# Altium schematic sheet agv_drv.SchDoc
size A2; SheetNumber: 1; SheetTotal: 1; SPICEModelCacheEXLCZDAJ: <root> / <DocumentId>EXLCZDAJ</DocumentId> / <CacheFrame Number="0"> / <Model Name="cap" Kind="MDL"> / <Text>*Default semiconductor capacitor / .MODEL CAP C()</Text> / </Model> / </CacheFrame> / </root>
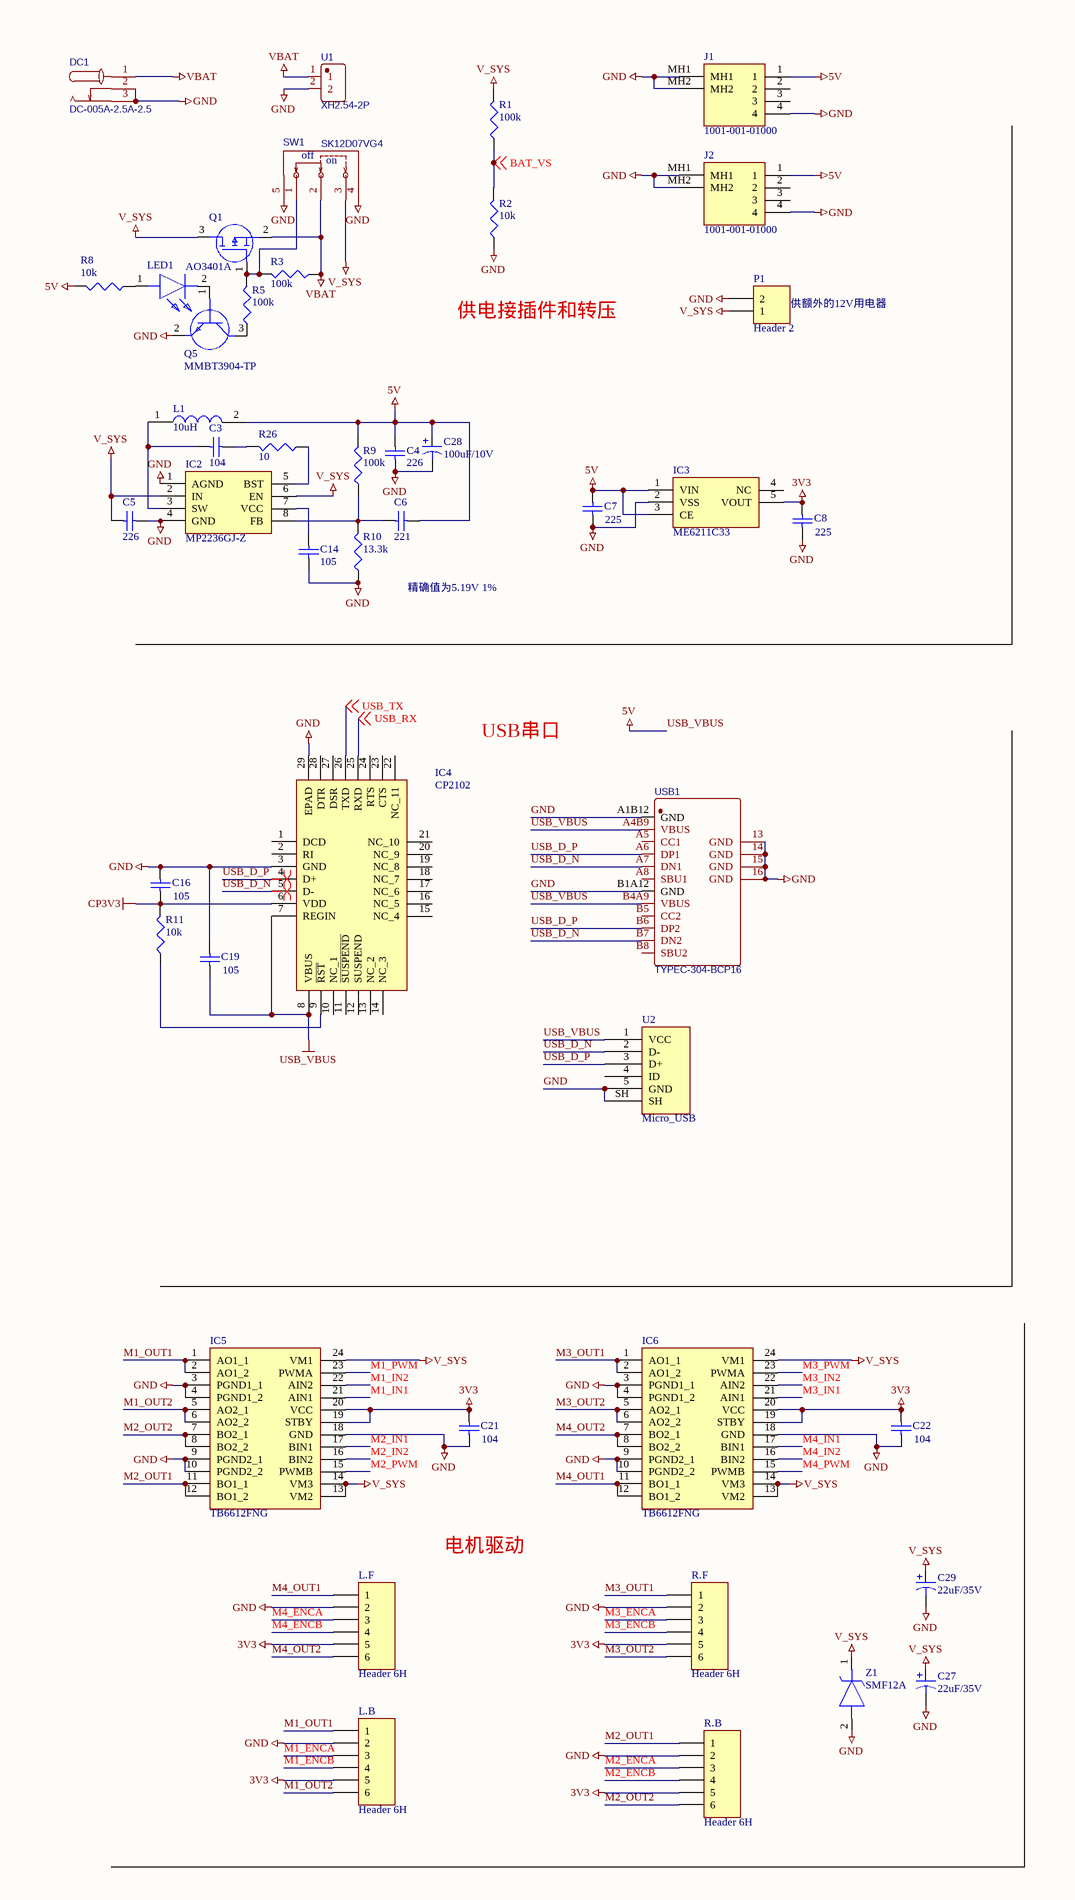
[diagram p0: agv_drv.SchDoc, left]
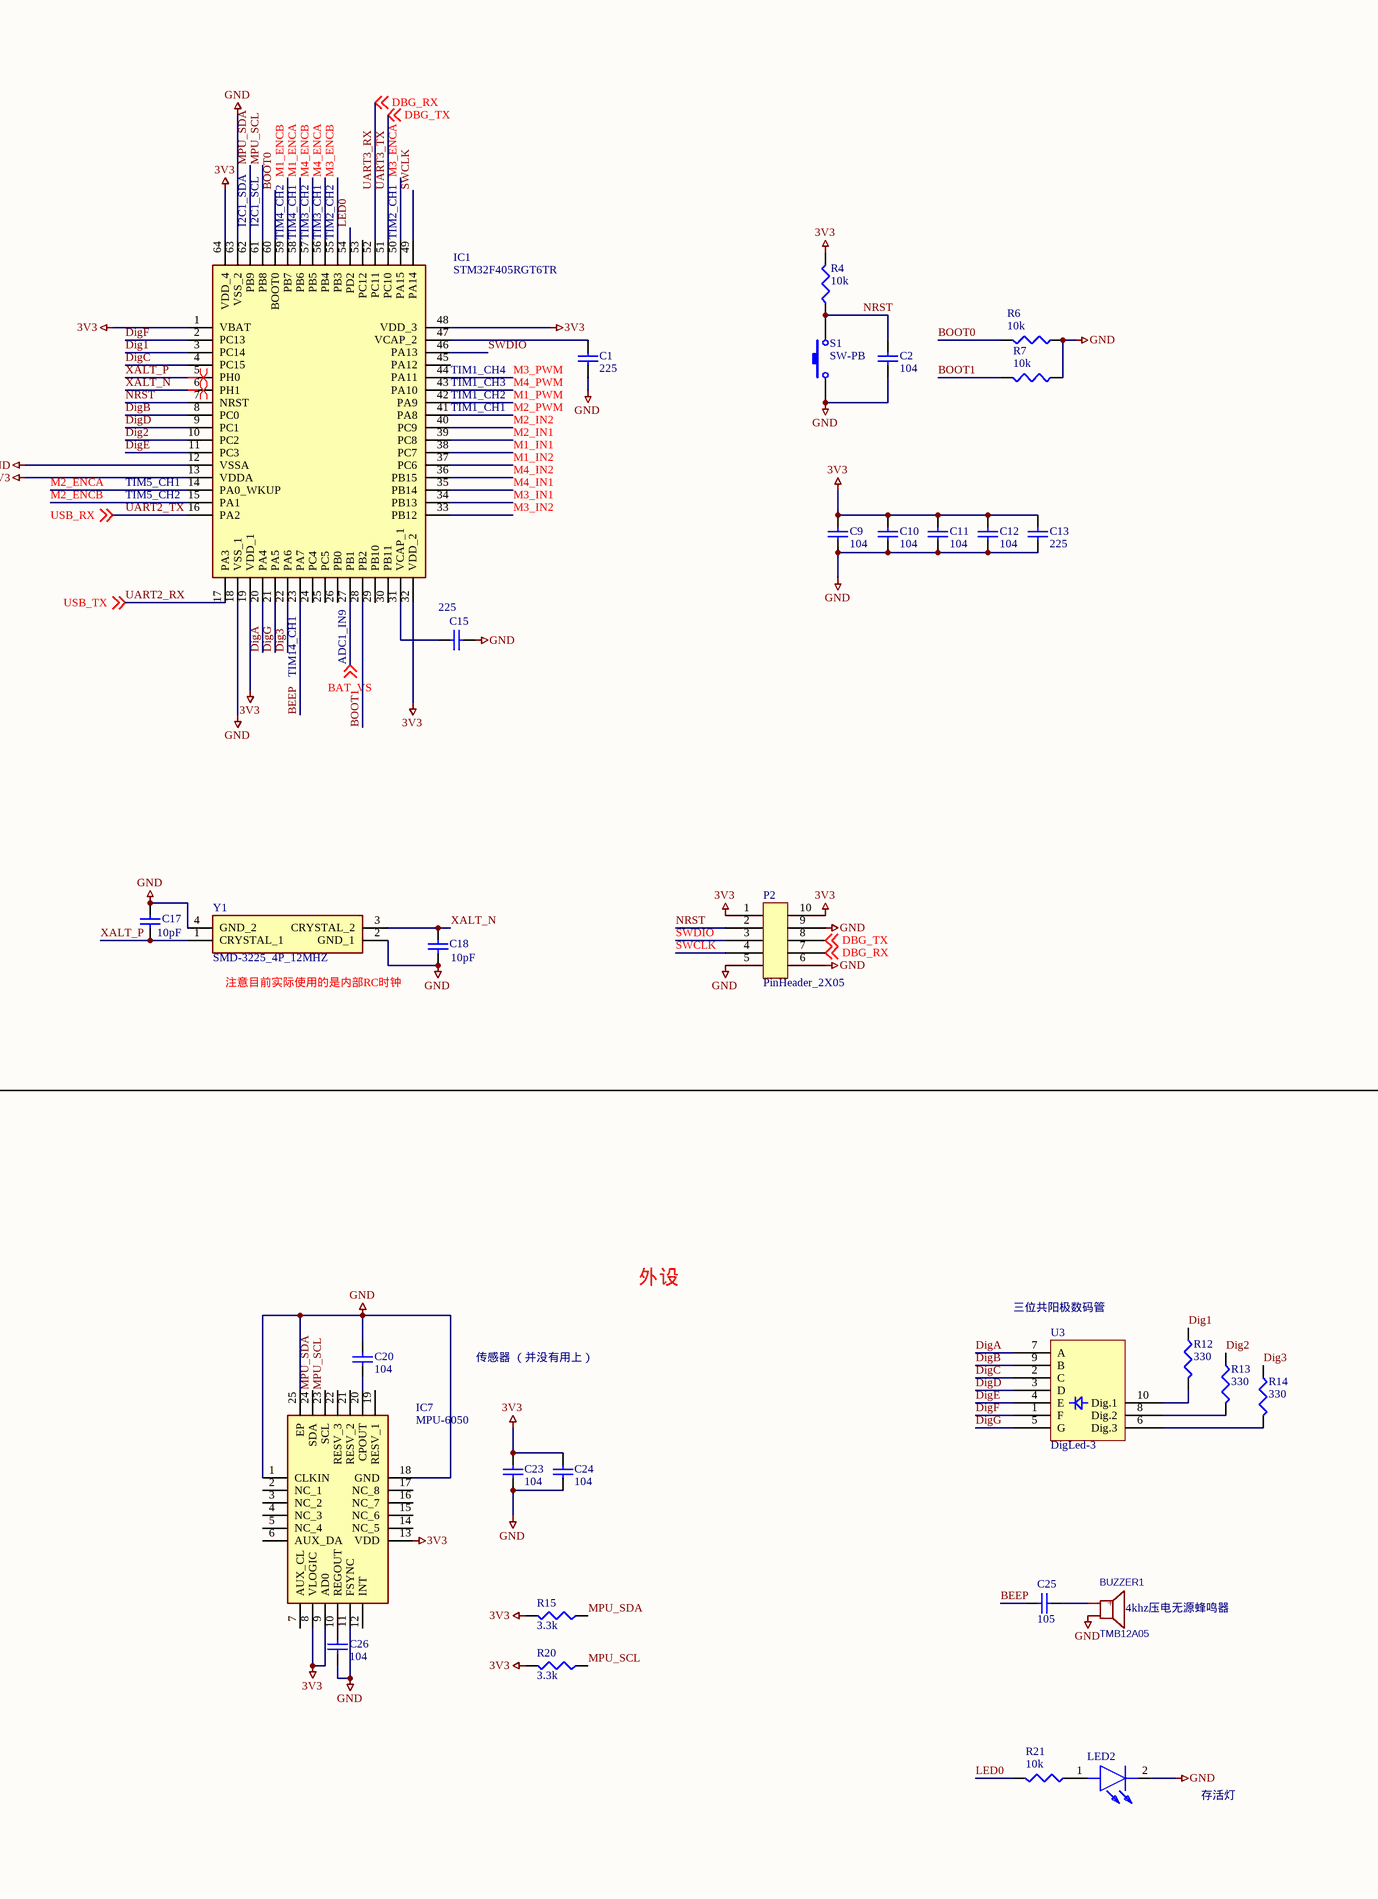
[diagram p1: agv_drv.SchDoc, right]

## Parts
BUZZER1  TMB12A05  [BUZ-TH_BD12.5-P6.50-D0.8-FD]
C1  225  [1608[0603]]
C2  104  [1608[0603]]
C3  104  [1608[0603]]
C4  226  [C1206]
C5  226  [C1206]
C6  221  [1608[0603]]
C7  225  [1608[0603]]
C8  225  [1608[0603]]
C9  104  [1608[0603]]
C10  104  [1608[0603]]
C11  104  [1608[0603]]
C12  104  [1608[0603]]
C13  225  [1608[0603]]
C14  105  [1608[0603]]
C15  225  [1608[0603]]
C16  105  [1608[0603]]
C17  10pF  [1608[0603]]
C18  10pF  [1608[0603]]
C19  105  [1608[0603]]
C20  104  [1608[0603]]
C21  104  [1608[0603]]
C22  104  [1608[0603]]
C23  104  [1608[0603]]
C24  104  [1608[0603]]
C25  105  [1608[0603]]
C26  104  [1608[0603]]
C27  22uF/35V  [CAPAE5550X54L]
C28  100uF/10V  [CAPAE5550X54L]
C29  22uF/35V  [CAPAE5550X54L]
DC1  DC-005A-2.5A-2.5  [DC-IN-TH_DC-005A-2.5A-2.5]
IC1  STM32F405RGT6TR  [QFP50P1200X1200X160-64N]
IC2  MP2236GJ-Z  [SOT65P280X100-8N]
IC3  ME6211C33  [SOT95P282X145-5N]
IC4  CP2102  [QFN50P500X500X100-29N-D]
IC5  TB6612FNG  [SOP65P760X160-24N]
IC6  TB6612FNG  [SOP65P760X160-24N]
IC7  MPU-6050  [QFN50P400X400X95-25N]
J1  1001-001-01000  [100100101000]
J2  1001-001-01000  [100100101000]
L1  10uH  [INDPM7266X300N]
L.B  Header 6H  [HDR2.0-LI-6P]
L.F  Header 6H  [HDR2.0-LI-6P]
LED1  LED0805  [LED0805]  (value not drawn)
LED2  LED0805  [LED0805]  (value not drawn)
P1  Header 2  [PinSocket_1X02_P5.00MM]
P2  PinHeader_2X05  [SidePinHeader_2x05_P2.54mm]
Q1  AO3401A  [SOT95P280X125-3N]
Q5  MMBT3904-TP  [SOT95P280X125-3N]
R1  100k  [J1-0603]
R2  10k  [J1-0603]
R3  100k  [J1-0603]
R4  10k  [J1-0603]
R5  100k  [J1-0603]
R6  10k  [J1-0603]
R7  10k  [J1-0603]
R8  10k  [J1-0603]
R9  100k  [J1-0603]
R10  13.3k  [J1-0603]
R11  10k  [J1-0603]
R12  330  [J1-0603]
R13  330  [J1-0603]
R14  330  [J1-0603]
R15  3.3k  [J1-0603]
R20  3.3k  [J1-0603]
R21  10k  [J1-0603]
R26  10  [J1-0603]
R.B  Header 6H  [HDR2.0-LI-6P]
R.F  Header 6H  [HDR2.0-LI-6P]
S1  SW-PB  [SW_PB2_A1]
SW1  SK12D07VG4  [SW-TH_SK12D07VG4]
U1  XH2.54-2P  [CONN-TH_XH2.54-2P]
U2  Micro_USB  [MicroUSB]
U3  DigLed-3  [DigLed-3-0.25inch]
USB1  TYPEC-304-BCP16  [USB-C-SMD_TYPEC-304-BCP16]
Y1  SMD-3225_4P_12MHZ  [SMD3225_4P12288MHZ12PF10PPM4085]
Z1  SMF12A  [SODFL3718X108N]

## Nets
3V3: C8.2 C9.2 C10.2 C11.2 C12.2 C13.2 C21.1 C22.1 C23.2 C24.2 IC1.1(VBAT) IC1.13(VDDA) IC1.19(VDD_1) IC1.32(VDD_2) IC1.48(VDD_3) IC1.64(VDD_4) IC3.5(VOUT) IC5.19(STBY) IC5.20(VCC) IC6.19(STBY) IC6.20(VCC) IC7.8(VLOGIC) IC7.9(AD0) IC7.13(VDD) L.B.5 L.F.5 P2.1 P2.10 R4.2 R15.2 R20.2 R.B.5 R.F.5
CP3V3: C16.1 IC4.6(VDD) R11.2
GND: BUZZER1.2 C1.2 C2.1 C4.1 C5.1 C7.1 C8.1 C9.1 C10.1 C11.1 C12.1 C13.1 C14.2 C15.2 C16.2 C17.2 C18.1 C19.2 C20.2 C21.2 C22.2 C23.1 C24.1 C26.1 C27.2 C28.2 C29.2 DC1.2 DC1.3 IC1.12(VSSA) IC1.18(VSS_1) IC1.63(VSS_2) IC2.1(AGND) IC2.4(GND) IC3.2(VSS) IC4.3(GND) IC4.29(EPAD) IC5.3(PGND1_1) IC5.4(PGND1_2) IC5.9(PGND2_1) IC5.10(PGND2_2) IC5.18(GND) IC6.3(PGND1_1) IC6.4(PGND1_2) IC6.9(PGND2_1) IC6.10(PGND2_2) IC6.18(GND) IC7.1(CLKIN) IC7.11(FSYNC) IC7.18(GND) IC7.25(EP) J1.4 J1.MH1 J1.MH2 J2.4 J2.MH1 J2.MH2 L.B.2 L.F.2 LED2.2(K) P1.2 P2.5 P2.6 P2.9 Q5.2(E) R2.1 R6.1 R7.1 R10.1 R.B.2 R.F.2 S1.1 SW1.4 SW1.5 U1.2 U2.5(GND) U2.SH USB1.13(GND) USB1.14(GND) USB1.15(GND) USB1.16(GND) USB1.A1B12(GND) USB1.B1A12(GND) Y1.2(GND_1) Y1.4(GND_2) Z1.2(A)
USB_VBUS: C4.2 C6.1 C7.2 C19.1 C28.1 IC3.1(VIN) IC3.3(CE) IC4.7(REGIN) IC4.8(VBUS) J1.1 J2.1 L1.2 R8.2 R9.2 U2.1(VCC) USB1.A4B9(VBUS) USB1.B4A9(VBUS)  [also labelled 5V]
V_SYS: C5.2 C27.1 C29.1 IC2.2(IN) IC2.6(EN) IC5.13(VM2) IC5.14(VM3) IC5.24(VM1) IC6.13(VM2) IC6.14(VM3) IC6.24(VM1) P1.1 Q1.3(D) R1.2 SW1.3 Z1.1(K)
VBAT: DC1.1 Q1.2(S) R3.1 SW1.2 U1.1
BAT_VS: IC1.27(PB1) R1.1 R2.2 ; off-sheet BAT_VS
BEEP: C25.2 IC1.23(PA7)
BOOT0: IC1.60(BOOT0) R6.2
BOOT1: IC1.28(PB2) R7.2
Dig1: IC1.3(PC14) R12.1
Dig2: IC1.10(PC2) R13.1
Dig3: IC1.22(PA6) R14.1
DigA: IC1.20(PA4) U3.7(A)
DigB: IC1.8(PC0) U3.9(B)
DigC: IC1.4(PC15) U3.2(C)
DigD: IC1.9(PC1) U3.3(D)
DigE: IC1.11(PC3) U3.4(E)
DigF: IC1.2(PC13) U3.1(F)
DigG: IC1.21(PA5) U3.5(G)
LED0: IC1.54(PD2) R21.2
M1_ENCA: IC1.58(PB6) L.B.3
M1_ENCB: IC1.59(PB7) L.B.4
M1_IN1: IC1.38(PC7) IC5.21(AIN1)
M1_IN2: IC1.37(PC6) IC5.22(AIN2)
M1_OUT1: IC5.1(AO1_1) IC5.2(AO1_2) L.B.1
M1_OUT2: IC5.5(AO2_1) IC5.6(AO2_2) L.B.6
M1_PWM: IC1.42(PA9) IC5.23(PWMA)
M2_ENCA: IC1.14(PA0_WKUP) R.B.3
M2_ENCB: IC1.15(PA1) R.B.4
M2_IN1: IC1.39(PC8) IC5.17(BIN1)
M2_IN2: IC1.40(PC9) IC5.16(BIN2)
M2_OUT1: IC5.11(BO1_1) IC5.12(BO1_2) R.B.1
M2_OUT2: IC5.7(BO2_1) IC5.8(BO2_2) R.B.6
M2_PWM: IC1.41(PA8) IC5.15(PWMB)
M3_ENCA: IC1.50(PA15) R.F.3
M3_ENCB: IC1.55(PB3) R.F.4
M3_IN1: IC1.34(PB13) IC6.21(AIN1)
M3_IN2: IC1.33(PB12) IC6.22(AIN2)
M3_OUT1: IC6.1(AO1_1) IC6.2(AO1_2) R.F.1
M3_OUT2: IC6.5(AO2_1) IC6.6(AO2_2) R.F.6
M3_PWM: IC1.44(PA11) IC6.23(PWMA)
M4_ENCA: IC1.56(PB4) L.F.3
M4_ENCB: IC1.57(PB5) L.F.4
M4_IN1: IC1.35(PB14) IC6.17(BIN1)
M4_IN2: IC1.36(PB15) IC6.16(BIN2)
M4_OUT1: IC6.11(BO1_1) IC6.12(BO1_2) L.F.1
M4_OUT2: IC6.7(BO2_1) IC6.8(BO2_2) L.F.6
M4_PWM: IC1.43(PA10) IC6.15(PWMB)
MPU_SCL: IC1.61(PB8) IC7.23(SCL) R20.1
MPU_SDA: IC1.62(PB9) IC7.24(SDA) R15.1
NRST: C2.2 IC1.7(NRST) P2.2 R4.1 S1.2
SWCLK: IC1.49(PA14) P2.4
SWDIO: IC1.46(PA13) P2.3
UART2_RX: IC1.17(PA3) IC4.26(TXD) ; off-sheet USB_TX  [also labelled USB_TX]
UART2_TX: IC1.16(PA2) IC4.25(RXD) ; off-sheet USB_RX  [also labelled USB_RX]
UART3_RX: IC1.52(PC11) P2.7 ; off-sheet DBG_RX  [also labelled DBG_RX]
UART3_TX: IC1.51(PC10) P2.8 ; off-sheet DBG_TX  [also labelled DBG_TX]
USB_D_N: IC4.5(D-) U2.2(D-) USB1.A7(DN1) USB1.B7(DN2)
USB_D_P: IC4.4(D+) U2.3(D+) USB1.A6(DP1) USB1.B6(DP2)
XALT_N: C18.2 IC1.6(PH1) Y1.3(CRYSTAL_2)
XALT_P: C17.1 IC1.5(PH0) Y1.1(CRYSTAL_1)
NetBUZZER1_1: BUZZER1.1(+) C25.1
NetC1_1: C1.1 IC1.47(VCAP_2)
NetC3_1: C3.1 IC2.3(SW) L1.1
NetC3_2: C3.2 R26.2
NetC6_2: C6.2 IC2.8(FB) R9.1 R10.2
NetC14_1: C14.1 IC2.7(VCC)
NetC15_1: C15.1 IC1.31(VCAP_1)
NetC20_1: C20.1 IC7.20(CPOUT)
NetC26_2: C26.2 IC7.10(REGOUT)
NetIC2_5: IC2.5(BST) R26.1
NetIC4_9: IC4.9(~{RST}) R11.1
NetLED1_1: LED1.1(A) R8.1
NetLED1_2: LED1.2(K) Q5.1(B)
NetLED2_1: LED2.1(A) R21.1
NetQ1_1: Q1.1(G) R3.2 R5.2 SW1.1
NetQ5_3: Q5.3(C) R5.1
NetR12_2: R12.2 U3.10(Dig.1)
NetR13_2: R13.2 U3.8(Dig.2)
NetR14_2: R14.2 U3.6(Dig.3)

Not connected (* = marked no-connect by the designer): IC1 24(PC4) 25(PC5) 26(PB0) 29(PB10) 30(PB11) 45(PA12) 53(PC12); IC3 4(NC); IC4 1(DCD) 2(RI) 10(NC_1) 11(~{SUSPEND}) 12(SUSPEND) 13(NC_2) 14(NC_3) 15(NC_4) 16(NC_5) 17(NC_6) 18(NC_7) 19(NC_8) 20(NC_9) 21(NC_10) 22(NC_11) 23(CTS) 24(RTS) 27(DSR) 28(DTR); IC7 2(NC_1) 3(NC_2) 4(NC_3) 5(NC_4) 6(AUX_DA) 7(AUX_CL) 12(INT) 14(NC_5) 15(NC_6) 16(NC_7) 17(NC_8) 19(RESV_1) 21(RESV_2) 22(RESV_3); J1 2 3; J2 2 3; U2 4(ID); USB1 A5(CC1) A8(SBU1) B5(CC2) B8(SBU2)

## Layout directives
differential pair: USB_D_N, USB_D_P, XALT_N, XALT_P

## Notes on the sheet
- (near SW1) off
- (near SW1) on
- (near IC1) I2C1_SDA
- (near IC1) I2C1_SCL
- (near IC1) TIM4_CH2
- (near IC1) TIM4_CH1
- (near IC1) TIM3_CH2
- (near IC1) TIM3_CH1
- (near IC1) TIM2_CH2
- (near IC1) TIM2_CH1
- 供电接插件和转压
- (near P1) 供额外的12V用电器
- (near IC1) TIM1_CH2
- (near IC1) TIM1_CH3
- (near IC1) TIM1_CH4
- (near IC1) TIM1_CH1
- (near IC1) TIM5_CH2
- (near IC1) TIM5_CH1
- 精确值为5.19V 1%
- (near IC1) TIM14_CH1
- (near IC1) ADC1_IN9
- USB串口
- (near Y1) 注意目前实际使用的是内部RC时钟
- 外设
- (near U3) 三位共阳极数码管
- 传感器 （并没有用上）
- 电机驱动
- (near BUZZER1) 4khz压电无源蜂鸣器
- 存活灯

## Library data of the parts
BUZZER1 = TMB12A05: BOM_Manufacturer: HNDZ; BOM_Supplier: LCSC; BOM_Manufacturer Part: TMB12A05; BOM_Supplier Part: C96093; BOM_JLCPCB Part Class: Extended Part; spicePre: B; spiceSymbolName: TMB12A05
C1-C26 = Cap Semi: Capacitor (Semiconductor SIM Model); Published: 8-Jun-2000; LatestRevisionDate: 29-May-2009; LatestRevisionNote: IPC-7351 Footprint Added.; PackageReference: C1206; Publisher: Altium Limited; PackageDescription: Chip Capacitor
C27-C29 = Cap Pol1: Polarized Capacitor (Radial); Published: 8-Jun-2000; LatestRevisionDate: 17-Jul-2002; LatestRevisionNote: Re-released for DXP Platform.; PackageReference: RB7.6-15; Publisher: Altium Limited; PackageDescription: Polarized Capacitor (Radial); 2 Leads
DC1 = DC-005A-2.5A-2.5: BOM_Manufacturer: XKB Connectivity(中国星坤); Contributor: LCSC; BOM_Supplier: LCSC; BOM_Supplier Part: C480364; BOM_Manufacturer Part: DC-005A-2.5A-2.5; BOM_JLCPCB Part Class: Extended Part; spicePre: D; spiceSymbolName: DC-005A-2.5A-2.5
IC1 = STM32F405RGT6TR: Integrated Circuit; Manufacturer_Name: STMicroelectronics; Datasheet Link: http://www.st.com/web/en/resource/technical/document/datasheet/DM00037051.pdf; Height: 1.6mm; Manufacturer_Part_Number: STM32F405RGT6TR; Mouser Part Number: 511-STM32F405RGT6TR; Mouser Price/Stock: https://www.mouser.co.uk/ProductDetail/STMicroelectronics/STM32F405RGT6TR?qs=MavH1QghrkHshpR6GkvPIg%3D%3D; Arrow Part Number: STM32F405RGT6TR; Arrow Price/Stock: https://www.arrow.com/en/products/stm32f405rgt6tr/stmicroelectronics?region=nac
IC2 = MP2236GJ-Z: Integrated Circuit; Manufacturer_Name: Monolithic Power Systems (MPS); Datasheet Link: https://www.mouser.in/datasheet/2/277/MP2236-2945671.pdf; Height: 1mm; Manufacturer_Part_Number: MP2236GJ-Z; Mouser Part Number: 946-MP2236GJ-Z; Mouser Price/Stock: https://www.mouser.co.uk/ProductDetail/Monolithic-Power-Systems-MPS/MP2236GJ-Z?qs=Zz7%252BYVVL6bGyotdSEmskgA%3D%3D
IC3 = ME6211C33M5G: Integrated Circuit; Manufacturer_Name: Microne; Datasheet Link: http://xinhuidianzi.com.cn/UploadSysFiles/files/LDO-series/ME6211-Series_E15.0.pdf; Height: 1.45mm; Manufacturer_Part_Number: ME6211C33M5G
IC4 = CP2102: Integrated Circuit; Manufacturer_Name: Silicon Labs; Datasheet Link: https://componentsearchengine.com/Datasheets/1/CP2102.pdf; Height: 1mm; Manufacturer_Part_Number: CP2102; Mouser Part Number: 634-CP2102; Mouser Price/Stock: https://www.mouser.co.uk/ProductDetail/Silicon-Labs/CP2102?qs=ucY0lxHzU7615lOm95XT0w%3D%3D
IC5 IC6 = TB6612FNG: Integrated Circuit; Manufacturer_Name: Toshiba; Datasheet Link: https://datasheet.datasheetarchive.com/originals/distributors/SFDatasheet-6/sf-000138015.pdf; Height: 1.6mm; Manufacturer_Part_Number: TB6612FNG
IC7 = MPU-6050: Integrated Circuit; Manufacturer_Name: TDK; Datasheet Link: https://datasheet.lcsc.com/szlcsc/TDK-InvenSense-MPU-6050_C24112.pdf; Height: 0.95mm; Manufacturer_Part_Number: MPU-6050; Mouser Part Number: 410-MPU-6050; Mouser Price/Stock: https://www.mouser.co.uk/ProductDetail/TDK-InvenSense/MPU-6050?qs=u4fy%2FsgLU9O14B5JgyQFvg%3D%3D; Arrow Part Number: MPU-6050; Arrow Price/Stock: https://www.arrow.com/en/products/mpu-6050/invensense?region=nac
J1 J2 = 1001-001-01000: Connector; Manufacturer_Name: CNC Tech; Datasheet Link: http://www.cnctech.us/pdfs/1001-001-01000_.pdf; Height: 7.15mm; Manufacturer_Part_Number: 1001-001-01000
L1 = ASPI-0630HI-4R7M-T15: Inductor; Manufacturer_Name: ABRACON; Datasheet Link: https://abracon.com/Support/PackageDrawing/Magnetics/ASPI-0630HI.PDF; Height: 3mm; Manufacturer_Part_Number: ASPI-0630HI-4R7M-T15; Mouser Part Number: 815-ASPI0630HI4R7T15; Mouser Price/Stock: https://www.mouser.com/Search/Refine.aspx?Keyword=815-ASPI0630HI4R7T15; Arrow Part Number: ASPI-0630HI-4R7M-T15; Arrow Price/Stock: https://www.arrow.com/en/products/aspi-0630hi-4r7m-t15/abracon
L.B L.F R.B R.F = Header 6H: Header, 6-Pin, Right Angle; LatestRevisionDate: 17-Jul-2002; LatestRevisionNote: Re-released for DXP Platform.; Publisher: Altium Limited
LED1 LED2 = LED: Manufacturer_Name: Everlight; Manufacturer_Part_Number: 17-21SURC/S530-A3/TR8; Datasheet Link: https://everlighteurope.com/index.php?controller=attachment?id_attachment=6172; Mouser Part Number: 638-1721SURCS530A3; Mouser Price/Stock: https://www.mouser.co.uk/ProductDetail/Everlight/17-21SURC-S530-A3-TR8?qs=8PzhAHr7IdPIULW1xNE5Hw%3D%3D; Arrow Part Number: 17-21SURC/S530-A3/TR8; Arrow Price/Stock: https://www.arrow.com/en/products/17-21surcs530-a3tr8/everlight-electronics?region=nac
P1 = Header 2: Header, 2-Pin; LatestRevisionDate: 17-Jul-2002; LatestRevisionNote: Re-released for DXP Platform.; Publisher: Altium Limited
Q1 = AO3401A: MOSFET (P-Channel); Manufacturer_Name: Alpha & Omega Semiconductors; Datasheet Link: http://www.aosmd.com/pdfs/datasheet/AO3401A.pdf; Height: 1.25mm; Manufacturer_Part_Number: AO3401A; Arrow Part Number: AO3401A; Arrow Price/Stock: https://www.arrow.com/en/products/ao3401a/alpha-and-omega-semiconductor?region=nac
Q5 = MMBT3904-TP: Transistor BJT NPN; Manufacturer_Name: Micro Commercial Components (MCC); Datasheet Link: https://componentsearchengine.com/Datasheets/1/MMBT3904-TP.pdf; Manufacturer_Part_Number: MMBT3904-TP; Mouser Part Number: 833-MMBT3904-TP; Mouser Price/Stock: https://www.mouser.co.uk/ProductDetail/Micro-Commercial-Components-MCC/MMBT3904-TP?qs=KFo7JewZbUHicjDjIayULQ%3D%3D; Arrow Part Number: MMBT3904-TP; Arrow Price/Stock: https://www.arrow.com/en/products/mmbt3904-tp/micro-commercial-components
R1-R15 R20 R21 R26 = Res3: Resistor; Published: 8-Jun-2000; LatestRevisionDate: 29-May-2009; LatestRevisionNote: IPC-7351 Footprint Added.; PackageReference: J1-0603; Publisher: Altium Limited; PackageDescription: Chip Resistor
S1 = SW-PB: Switch; Published: 24-Mar-1999; LatestRevisionDate: 17-Jul-2002; LatestRevisionNote: Re-released for DXP Platform.; PackageReference: SPST-2; Publisher: Altium Limited; PackageDescription: Switch; 2 Leads
SW1 = SK12D07VG4: BOM_Manufacturer: SHOU HAN; Contributor: LCSC; BOM_Supplier: LCSC; BOM_Supplier Part: C393937; BOM_Manufacturer Part: SK12D07VG4; BOM_JLCPCB Part Class: Extended Part; spicePre: S; spiceSymbolName: SK12D07VG4
U1 = XH2.54-2P: BOM_Manufacturer: null; BOM_Manufacturer Part: XH2.54-2P立式座子; Contributor: LCSC; BOM_Supplier: LCSC; BOM_Supplier Part: C2888344; BOM_JLCPCB Part Class: Extended Part; spicePre: U; spiceSymbolName: XH2.54-2P立式座子
U2 = Micro_USB: micro USB B型座子
U3 = DigLed-3: 共阳极三位数码管
USB1 = TYPEC-304-BCP16: BOM_Manufacturer: XUNPU; Contributor: LCSC; BOM_Supplier: LCSC; BOM_Supplier Part: C720629; BOM_Manufacturer Part: TYPEC-304-BCP16; BOM_JLCPCB Part Class: Extended Part; spicePre: U; spiceSymbolName: TYPEC-304-BCP16
Y1 = SMD-3225_4P_12.288MHZ_12PF_10PPM_-40~+85: Crystal or Oscillator; Manufacturer_Name: TAE(Zhejiang Abel Elec); Manufacturer_Part_Number: SMD-3225_4P 12.288MHZ 12PF 10PPM -40~+85¡æ; Datasheet Link: https://datasheet.lcsc.com/szlcsc/1901241506_Zhejiang-Abel-Elec-SMD-3225-4P-12-288MHZ-12PF-10PPM-40-85_C362472.pdf; Height: 0.8mm
Z1 = SMF24A-E3-08: Zener Diode; Manufacturer_Name: Vishay; Datasheet Link: https://datasheet.datasheetarchive.com/originals/distributors/Datasheets-DGA26/1842521.pdf; Height: 1.08mm; Manufacturer_Part_Number: SMF24A-E3-08; Mouser Part Number: 78-SMF24A-E3-08; Mouser Price/Stock: https://www.mouser.co.uk/ProductDetail/Vishay-Semiconductors/SMF24A-E3-08?qs=EyVtPm1F4imZcejQQ1SSmA%3D%3D; Arrow Part Number: SMF24A-E3-08; Arrow Price/Stock: https://www.arrow.com/en/products/smf24a-e3-08/vishay?region=nac